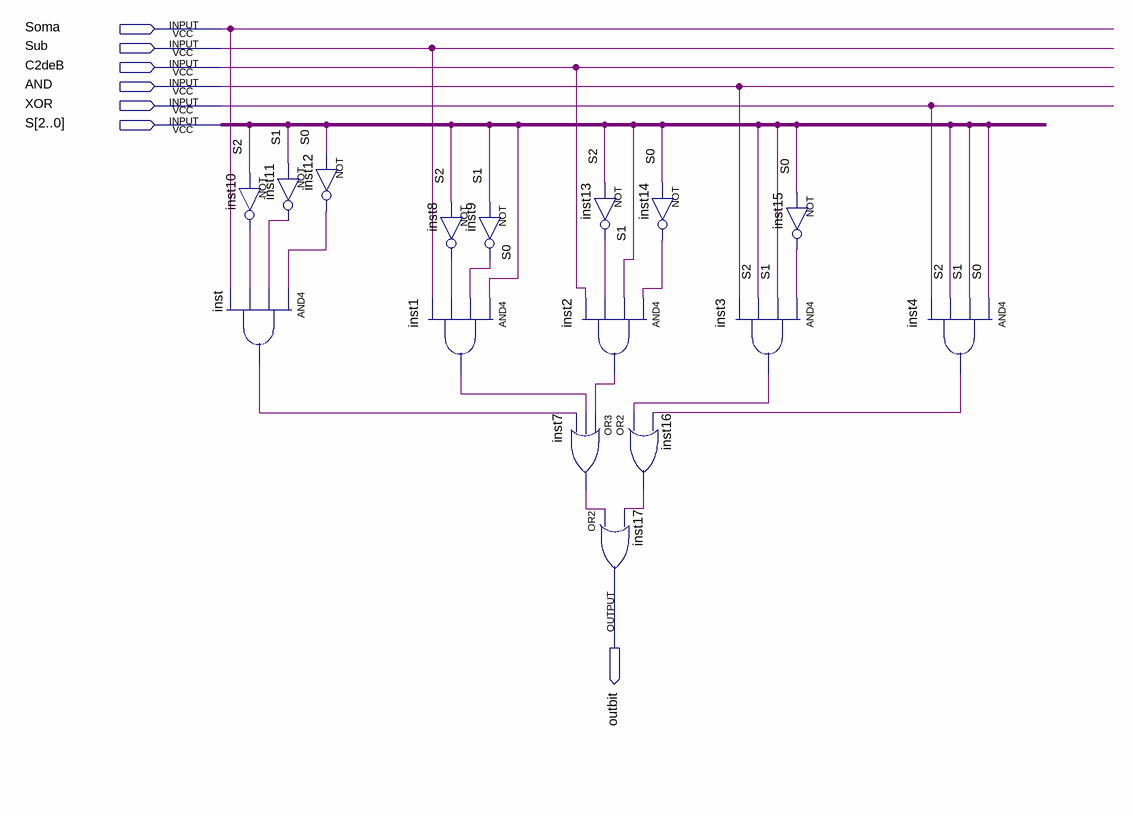
[diagram p0: schematic sheet]
// Quartus schematic miniMux.bdf as structural Verilog: 16 symbols, 7 pins
module miniMux (
  input  Soma,
  input  Sub,
  input  C2deB,
  input  AND,
  input  XOR,
  input  [2:0] S,
  output outbit
);

  wire inst1_out, inst2_out, inst3_out, inst4_out, inst7_out, inst8_out, inst9_out, inst10_out, inst11_out,
       inst12_out, inst13_out, inst14_out, inst15_out, inst16_out, inst_out;

  not inst10 (inst10_out, S[2]);
  and inst (inst_out, inst12_out, inst11_out, inst10_out, Soma);
  not inst12 (inst12_out, S[0]);
  not inst11 (inst11_out, S[1]);
  not inst8 (inst8_out, S[2]);
  not inst9 (inst9_out, S[1]);
  and inst1 (inst1_out, S[0], inst9_out, inst8_out, Sub);
  not inst13 (inst13_out, S[2]);
  and inst2 (inst2_out, inst14_out, S[1], inst13_out, C2deB);
  or inst7 (inst7_out, inst2_out, inst1_out, inst_out);
  or inst16 (inst16_out, inst3_out, inst4_out);
  or inst17 (outbit, inst7_out, inst16_out);
  not inst14 (inst14_out, S[0]);
  not inst15 (inst15_out, S[0]);
  and inst3 (inst3_out, inst15_out, S[1], S[2], AND);
  and inst4 (inst4_out, S[0], S[1], S[2], XOR);
endmodule
